# Altium project PCB_Project_2.PrjPcb
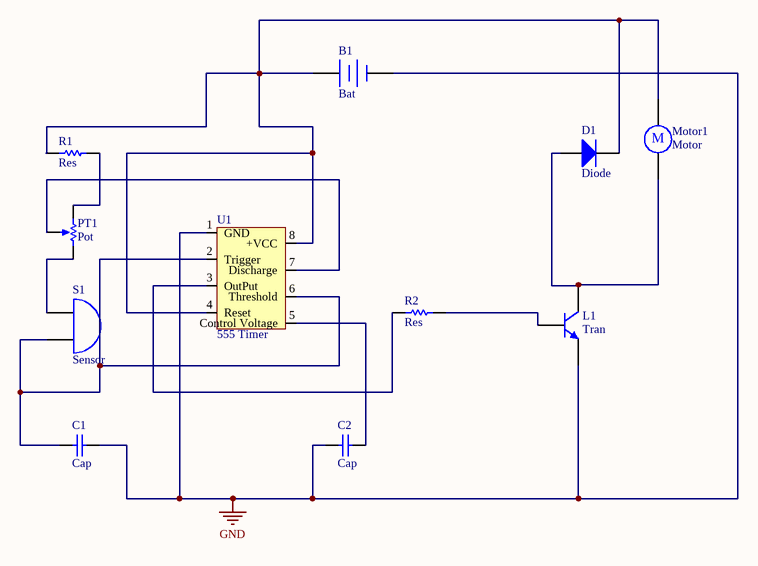
[diagram p0: AnalogHmwsch.SchDoc]
1 sheet, 11 parts. Net scope: global (net labels, ports and power ports of the same name join across sheets).
Board file: AnalogHmw.PcbDoc

## Sheet AnalogHmwsch.SchDoc
size A4

### Parts
B1  Bat  [Bat]
C1  Cap  [Cap]
C2  Cap  [Cap]
D1  Diode  [Diode]
L1  Tran  [Tran]
Motor1  Motor  [Motor]
PT1  Pot  [Pot]
R1  Res  [Res]
R2  Res  [Res]
S1  Sensor  [Sensor]
U1  555 Timer  [555 Timer]

### Nets
GND: B1.2(-) C1.2 C2.1 L1.3(E) U1.1(GND)
NetB1_1: B1.1(+) D1.2(K) Motor1.1 R1.1 U1.4(Reset) U1.8(+VCC)
NetC1_1: C1.1 S1.2(B) U1.2(Trigger) U1.6(Threshold)
NetC2_2: C2.2 U1.5(Control_Voltage)
NetD1_1: D1.1(A) L1.1(C) Motor1.2
NetL1_2: L1.2(B) R2.2
NetPT1_1: PT1.1(TOP) R1.2
NetPT1_2: PT1.2(BOT) S1.1(A)
NetPT1_3: PT1.3(TAP) U1.7(Discharge)
NetR2_1: R2.1 U1.3(OutPut)

### Notes on the sheet
- (in symbol Motor) M